# EasyEDA Pro project Rocket PCB Final.epro, schematic HexaFlight V3
Board Name: HexaFlight V3; Create Date: 2025-06-18; Page Name: MCU; Project Name: Routed HexaFlight; Schematic Name: HexaFlight V3; Update Date: 2025-06-20; Add into BOM: yes; Company: FEDEVEL; Convert to PCB: yes; Date: 2022-10-17; Draw By: robertferanec; REV: 1.0; Sheet: 1/1; spicePre: .
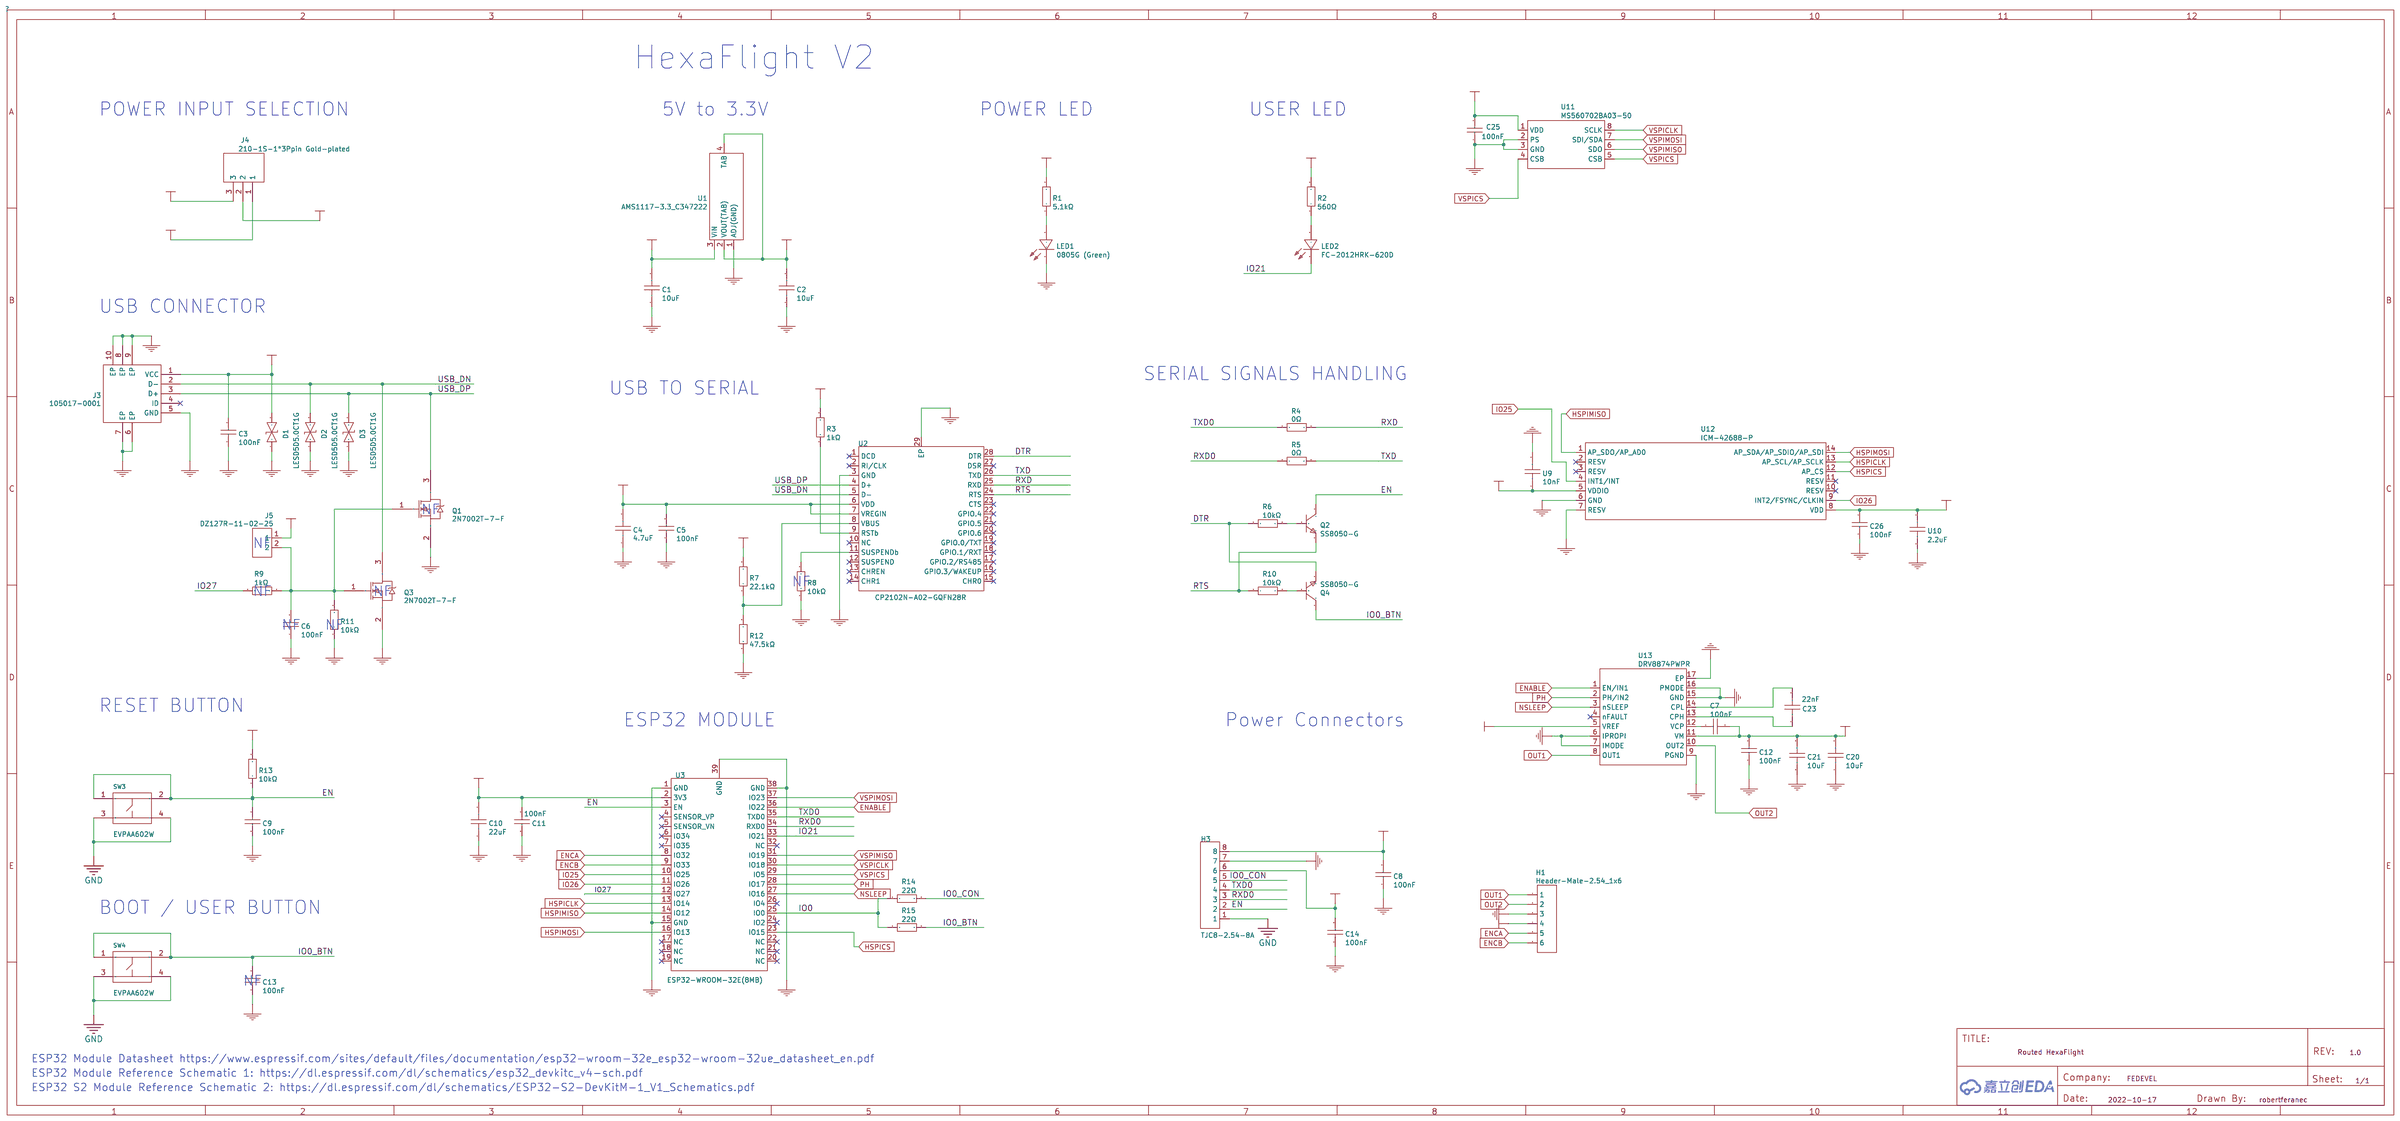
[diagram p0: schematic sheet]

## Parts
C1  10uF  [C1206]
C2  10uF  [C1206]
C3  100nF  [C0402]
C4  4.7uF  [C0603]
C5  100nF  [C0402]
C6  100nF  [C0402]
C7  100nF  [C0402]
C8  100nF  [C0402]
C9  100nF  [C0402]
C10  22uF  [C0805]
C11  100nF  [C0402]
C12  100nF  [C0402]
C13  100nF  [C0402]
C14  100nF  [C0402]
C20  10uF  [C1206]
C21  10uF  [C1206]
C23  22nF  [C0402]
C25  100nF  [C0402]
C26  100nF  [C0402]
D1  LESD5D5.0CT1G  [SOD-523_L1.2-W0.8-LS1.6-BI]
D2  LESD5D5.0CT1G  [SOD-523_L1.2-W0.8-LS1.6-BI]
D3  LESD5D5.0CT1G  [SOD-523_L1.2-W0.8-LS1.6-BI]
H1  Header-Male-2.54_1x6  [HDR-TH_6P-P2.54-V-M-1]
H3  TJC8-2.54-8A  [HDR-TH_8P-P2.54-V-M-4]
J3  105017-0001  [MICRO-USB-SMD_105017-0001]
J4  210-1S-1*3Ppin Gold-plated  [HDR-TH_3P-P1.27-V-M-1]
J5  DZ127R-11-02-25  [HDR-TH_2P-P1.27-V-M]
LED1  0805G (Green)  [LED0805-RD_GREEN]
LED2  FC-2012HRK-620D  [LED0805-RD_RED]
Q1  2N7002T-7-F  [SOT-523-3_L1.6-W0.8-P1.00-LS1.6-BR]
Q2  SS8050-G  [SOT-23-3_L2.9-W1.6-P1.90-LS2.8-BR]
Q3  2N7002T-7-F  [SOT-523-3_L1.6-W0.8-P1.00-LS1.6-BR]
Q4  SS8050-G  [SOT-23-3_L2.9-W1.6-P1.90-LS2.8-BR]
R1  5.1kΩ  [R0402]
R2  560Ω  [R0402]
R3  1kΩ  [R0402]
R4  0Ω  [R0402]
R5  0Ω  [R0402]
R6  10kΩ  [R0402]
R7  22.1kΩ  [R0402]
R8  10kΩ  [R0402]
R9  1kΩ  [R0402]
R10  10kΩ  [R0402]
R11  10kΩ  [R0402]
R12  47.5kΩ  [R0402]
R13  10kΩ  [R0402]
R14  22Ω  [R0402]
R15  22Ω  [R0402]
SW3  EVPAA602W  [KEY-TH_4P-L3.5-W4.9-P2.80-LS4.3]
SW4  EVPAA602W  [KEY-TH_4P-L3.5-W4.9-P2.80-LS4.3]
U1  AMS1117-3.3_C347222  [SOT-223-4_L6.5-W3.5-P2.30-LS7.0-BR]
U2  CP2102N-A02-GQFN28R  [QFN-28_L5.0-W5.0-P0.50-TL-EP3.3]
U3  ESP32-WROOM-32E(8MB)  [WIFI-SMD_ESP32-WROOM-32E]
U9  10nF  [C0402]
U10  2.2uF  [C0805]
U11  MS560702BA03-50  [SENSOR-SMD_MS560702BA03-50]
U12  ICM-42688-P  [LGA-14_L3.0-W2.5-P0.50-TL]
U13  DRV8874PWPR  [HTSSOP-16_L5.0-W4.4-P0.65-LS6.4-BL-EP]

## Library data of the parts
C1 C2 C20 C21 = CL31A106KBHNNNE: Capacitance: Tolerance:±10% Tolerance:±10% Voltage Rated: Temperature Coefficient:; LCSC Part Name: 10uF ±10% 50V; Supplier Part: C13585; Manufacturer: SAMSUNG(三星); Supplier Footprint: 1206; JLCPCB Part Class: Basic Part; Datasheet: https://atta.szlcsc.com/upload/public/pdf/source/20160218/1457707763339.pdf; Supplier: LCSC; Tolerance: ±10%
C3 C5-C9 C11-C14 C25 C26 = CL05B104KO5NNNC: Capacitance: Tolerance:±10% Tolerance:±10% Voltage Rated: Temperature Coefficient:; LCSC Part Name: 100nF ±10% 16V; Supplier Part: C1525; Manufacturer: SAMSUNG(三星); Supplier Footprint: 0402; JLCPCB Part Class: Basic Part; Datasheet: https://atta.szlcsc.com/upload/public/pdf/source/20160218/1457707763339.pdf; Supplier: LCSC; Tolerance: ±10%
C4 = CL10A475KO8NNNC: Capacitance: Tolerance:±10% Tolerance:±10% Voltage Rated: Temperature Coefficient:; LCSC Part Name: 4.7uF ±10% 16V; Supplier Part: C19666; Manufacturer: SAMSUNG(三星); Supplier Footprint: 0603; JLCPCB Part Class: Basic Part; Datasheet: https://atta.szlcsc.com/upload/public/pdf/source/20160218/1457707763339.pdf; Supplier: LCSC; Tolerance: ±10%
C10 = CL21A226MAQNNNE: Capacitance: Tolerance:±20% Tolerance:±20% Voltage Rated: Temperature Coefficient:; LCSC Part Name: 22uF ±20% 25V; Supplier Part: C45783; Manufacturer: SAMSUNG(三星); Supplier Footprint: 0805; JLCPCB Part Class: Basic Part; Datasheet: https://atta.szlcsc.com/upload/public/pdf/source/20160218/1457707763339.pdf; Supplier: LCSC; Tolerance: ±20%
C23 = 0402B223K500NT: Capacitance:22nF Tolerance:±10% Tolerance:±10% Voltage Rating:50V Temperature Coefficient:X7R; LCSC Part Name: 22nF ±10% 50V; Supplier Part: C1532; Manufacturer: FH(风华); Supplier Footprint: 0402; JLCPCB Part Class: Basic Part; Datasheet: https://atta.szlcsc.com/upload/public/pdf/source/20200305/C486355_26A10D38EF8C2A5C37091D0039909270.pdf; Supplier: LCSC; Tolerance: ±10%; Voltage Rating: 50V; Temperature Coefficient: X7R
D1-D3 = LESD5D5.0CT1G: Supplier: LCSC; Supplier Part: C383211; Manufacturer: Leshan Radio; JLCPCB Part Class: Extended Part; Contributor: LCSC; spicePre: D
H1 = Header-Male-2.54_1x6: Supplier: LCSC; Manufacturer: BOOMELE(博穆精密); Manufacturer Part: 2.54-1x6P直针; Supplier Part: C37208; JLCPCB Part Class: Extended Part; spicePre: H
H3 = TJC8-2.54-8A: Supplier Part: C42410558; Manufacturer: DLL(德利); Supplier Footprint: 插件,P=2.54mm; Datasheet: https://atta.szlcsc.com/upload/public/pdf/source/20241209/340D1E38A9956937ED440F5074677EFE.pdf; Supplier: LCSC
J3 = 105017-0001: Supplier: LCSC; Manufacturer: MOLEX; Supplier Part: C136000; JLCPCB Part Class: Extended Part; Contributor: LCSC; spicePre: U
J4 = 210-1S-1*3Ppin Gold-plated: Supplier: LCSC; Manufacturer: Ckmtw; Supplier Part: C124354; JLCPCB Part Class: Extended Part; Contributor: LCSC; spicePre: H
J5 = DZ127R-11-02-25: Supplier: LCSC; Supplier Part: C2935942; Manufacturer: DEALON(德艺隆); JLCPCB Part Class: Extended Part; Contributor: LCSC; spicePre: H
LED1 = 0805G (Green): Supplier: LCSC; Manufacturer: KENTO; Supplier Part: C2297; JLCPCB Part Class: Basic Part; spicePre: L
LED2 = FC-2012HRK-620D: Supplier: LCSC; Manufacturer: NATIONSTAR; Supplier Part: C84256; JLCPCB Part Class: Basic Part; spicePre: L
Q1 Q3 = 2N7002T-7-F: Supplier: LCSC; Manufacturer: DIODES; Supplier Part: C139445; JLCPCB Part Class: Extended Part; Contributor: LCSC; spicePre: Q
Q2 Q4 = SS8050-G: Supplier: LCSC; Manufacturer: CJ(江苏长电/长晶); Supplier Part: C164886; JLCPCB Part Class: Extended Part; Contributor: LCSC; spicePre: Q
R1 = 5.1kΩ: Supplier: LCSC; Manufacturer: UniOhm; Manufacturer Part: 0402WGF5101TCE; Supplier Part: C25905; Resistance: 5.1K; JLCPCB Part Class: Basic Part; nameAlias: Resistance; spicePre: R; spiceSymbolName: 0402WGF5101TCE
R2 = 560Ω: Supplier: LCSC; Manufacturer: UniOhm; Manufacturer Part: 0402WGF5600TCE; Supplier Part: C25126; Resistance: 560; JLCPCB Part Class: Extended Part; nameAlias: Resistance; spicePre: R; spiceSymbolName: 0402WGF5600TCE
R3 R9 = 1kΩ: Supplier: LCSC; Manufacturer: UniOhm; Manufacturer Part: 0402WGF1001TCE; Supplier Part: C11702; Resistance: 1K; JLCPCB Part Class: Basic Part; nameAlias: Resistance; spicePre: R; spiceSymbolName: 0402WGF1001TCE
R4 R5 = 0Ω: Supplier: LCSC; Manufacturer: UniOhm; Manufacturer Part: 0402WGF0000TCE; Supplier Part: C17168; Resistance: 0; JLCPCB Part Class: Basic Part; nameAlias: Resistance; spicePre: R; spiceSymbolName: 0402WGF0000TCE
R6 R8 R10 R11 R13 = 10kΩ: Supplier: LCSC; Manufacturer: UniOhm; Manufacturer Part: 0402WGF1002TCE; Supplier Part: C25744; Resistance: 10K; JLCPCB Part Class: Basic Part; nameAlias: Resistance; spicePre: R; spiceSymbolName: 0402WGF1002TCE
R7 = 22.1kΩ: Supplier: LCSC; Manufacturer: UniOhm; Manufacturer Part: 0402WGF2212TCE; Supplier Part: C43473; Resistance: 22.1K; JLCPCB Part Class: Extended Part; nameAlias: Resistance; spicePre: R; spiceSymbolName: 0402WGF2212TCE
R12 = 47.5kΩ: Supplier: LCSC; Manufacturer: UniOhm; Manufacturer Part: 0402WGF4752TCE; Supplier Part: C25896; Resistance: 47.5K; JLCPCB Part Class: Extended Part; nameAlias: Resistance; spicePre: R; spiceSymbolName: 0402WGF4752TCE
R14 R15 = 22Ω: Supplier: LCSC; Manufacturer: UniOhm; Manufacturer Part: 0402WGF220JTCE; Supplier Part: C25092; Resistance: 22; JLCPCB Part Class: Basic Part; nameAlias: Resistance; spicePre: R; spiceSymbolName: 0402WGF220JTCE
